# EAGLE design miditendo_rev5 (EAGLE 6.1)
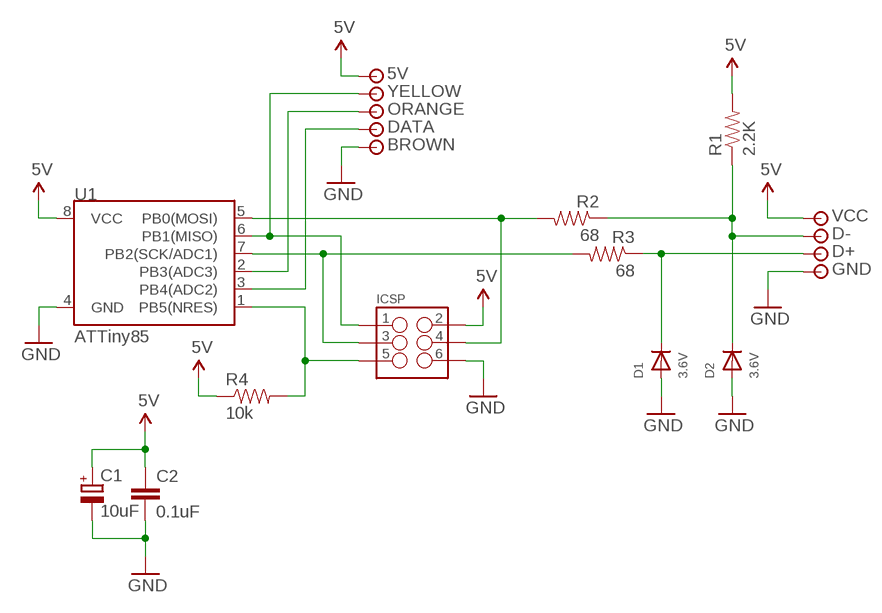
[diagram p0: schematic, sheet 1]

## Parts
5V  WIRE_JOINT  [THSOLDERPOINT]
BROWN  WIRE_JOINT  [THSOLDERPOINT]
C1  10uF  CPOL-EUB  [PANASONIC_B]
C2  0.1uF  C-EUC0805  [C0805]
D1  3.6V  DIODESOD-123  [SOD-123]
D2  3.6V  DIODESOD-123  [SOD-123]
D+  WIRE_JOINT  [THSOLDERPOINT]
D-  WIRE_JOINT  [THSOLDERPOINT]
DATA  WIRE_JOINT  [THSOLDERPOINT]
GND  WIRE_JOINT  [THSOLDERPOINT]
ICSP  M03X2SMT  [2X3_SMT_POSTS]
ORANGE  WIRE_JOINT  [THSOLDERPOINT]
R1  2.2K  RESISTOR0805  [0805]
R2  68  RESISTOR0805  [0805]
R3  68  RESISTOR0805  [0805]
R4  10k  RESISTOR0805  [0805]
U1  ATTiny85  ATTINY45TINY85-20-SMT  [SO08-EIAJ]
VCC  WIRE_JOINT  [THSOLDERPOINT]
YELLOW  WIRE_JOINT  [THSOLDERPOINT]

## Nets
5V: 5V.P$1 C1.+ C2.1 ICSP.2 R1.2 R4.1 U1.8(VCC) VCC.P$1
GND: BROWN.P$1 C1.- C2.2 D1.A D2.A GND.P$1 ICSP.6 U1.4(GND)
N$1: ICSP.4 R2.2 U1.5(PB0(MOSI))
N$2: ICSP.3 R3.2 U1.7(PB2(SCK/ADC1))
N$3: ICSP.1 U1.6(PB1(MISO)) YELLOW.P$1
N$4: ORANGE.P$1 U1.2(PB3(ADC3))
N$5: D2.C D-.P$1 R1.1 R2.1
N$6: DATA.P$1 U1.3(PB4(ADC2))
N$7: D1.C D+.P$1 R3.1
N$8: ICSP.5 R4.2 U1.1(PB5(NRES))

## Library data of the parts
5V BROWN D+ D- DATA GND ORANGE VCC YELLOW = miditendo:WIRE_JOINT
C1 = rcl:CPOL-EU: POLARIZED CAPACITOR, European symbol
C2 = rcl:C-EU: CAPACITOR, European symbol
D1 D2 = microbuilder:DIODE: Diode SMA Model Volts Amps Type Vf Vr Digikey # Notes SSA34-E3 40V 3A Schottky 480mV @ 3A 200uA @ 40V SSA34-E3/61TGITR-ND CDBA120-G 20V 1A Schottky 500mV @ 1A 500uA @ 20V 641-1014-6-ND REEL MBRA210 10V 2A Schottky 350mV @ 2A 700uA @ 10V MBRA210LT3 SOD-123 Model Volts Amps Type Vf Vr Order # Notes BAT54T1G 30V 200mA Schottky 800mV @ 200mA 2uA @ 25V BAT54T1GOSTR-ND B0530W 30V 500mA Schottky 430mV @ 500mA 130uA @ 30V B0530W-FDICT-ND REEL MBR120 1A 20V Schottky 340mV @ 1A MBR120VLSFT1GOSCT-ND SOD-323 Model Volts Amps Type Vf Vr Order # Notes PMEG2005EJ 20V 500mA Schottky 355mV @ 500mA 568-4110-1-ND ZLLS410 10V 570mA Schottky 380mV @ 570mA ZLLS410CT-ND 1N4148WS 75V 150mA Silicon/Simple 1V 1N4148WSFSCT-ND REEL SOD-523 Model Volts Amps Type Vf Vr Order # Notes BAT54XV2 30V 200mA Schottky 0.8V @ 100mA BAT54XV2CT-ND TB751S 30V 30mA Schottky RB751S-40TE61CT-ND SOT23-R/W (R = Solder Paste/Reflow Ovens, W = Hand-Soldering) Model Volts Amps Type Vf Vr Order # Notes BAT54FILM 40V 300mA Schottky 497-7162-1-ND
ICSP = SparkFun-Connectors:M03X2: 2x3 .1" header. Shrouded, with keying- CONN-10681 SMT- CONN-11415 Pogo pins- HW-11044; PROD_ID: CONN-11415
R1-R4 = miditendo:RESISTOR: RESISTOR
U1 = SparkFun-DigitalIC:ATTINY45: Atmel 8-pin 2/4/8kB flash uC; PROD_ID: IC-09092; VALUE: Tiny85-20-SMT

## Board
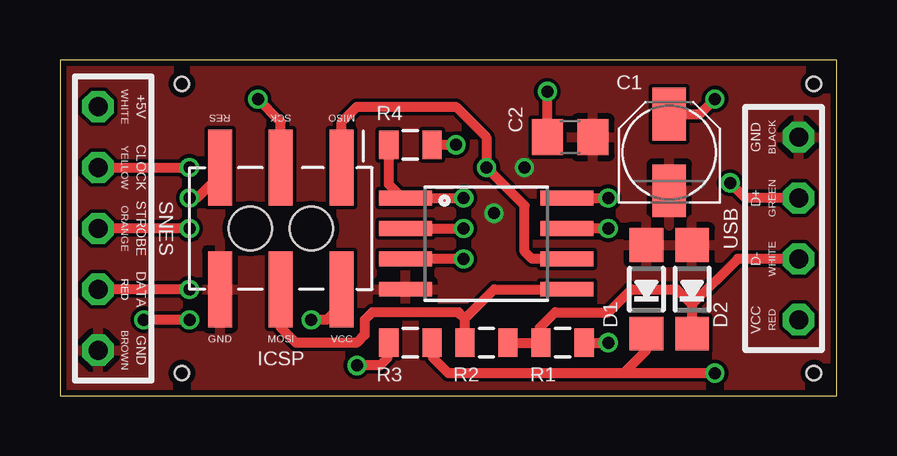
[diagram p1: board, top side]
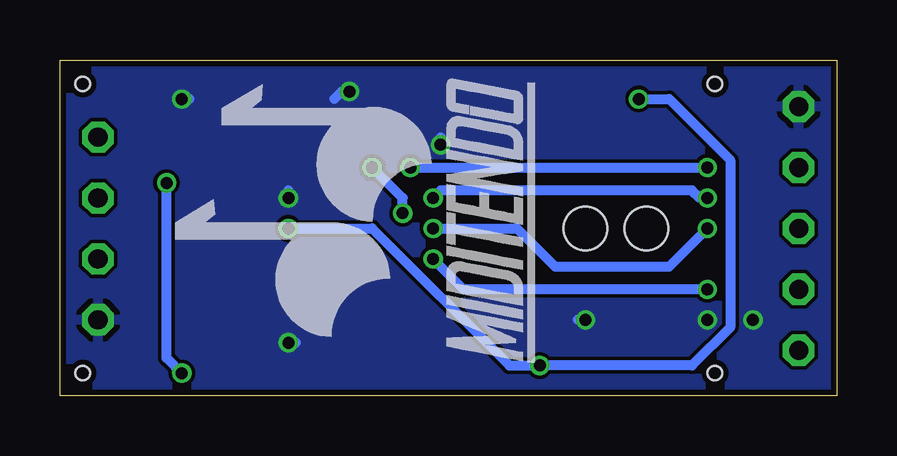
[diagram p2: board, bottom side, seen from below]

Size 32.38 x 14.02 mm. Coordinates in mm from the lower left corner, seen from the top.
Outline: 0,0 32.38,0 32.38,14.02 0,14.02 0,0
Copper layers (1*16): Top 0.035mm / dielectric 1.5mm / Bottom 0.035mm
Design rules: minimum track width 6mil, minimum drill 12mil, track to track 6mil, track to pad 6mil, pad to pad 6mil, via to via 6mil, smd to smd 0mil, copper to edge 10mil, drill to drill 10mil, minimum pad ring 10mil, minimum via ring 6mil, stop-mask expansion 2mil, vias tented up to drill 100mil, thermal gap 10mil
Holes 0.6 mm at 5.08,13.02 5.08,0.95 31.43,13.02 31.43,0.95

### Footprints (pad centres in the part's own frame; a part is rotated, then mirrored left to right if it is on the bottom)
THSOLDERPOINT = drill 0.8 octagon: P$1 0,0
PANASONIC_B = smd 2.2 x 1.4: + 1.6,0; - -1.6,0
C0805 = smd 1.3 x 1.5: 1 -0.95,0; 2 0.95,0
SOD-123 = smd 1.4 x 1.4: A 1.85,0; C -1.85,0
2X3_SMT_POSTS = smd 1 x 3.17: 1 -2.54,-2.54; 2 -2.54,2.54; 3 0,-2.54; 4 0,2.54; 5 2.54,-2.54; 6 2.54,2.54 | hole 1.8: -1.27,0; 1.27,0
0805 = smd 0.8 x 1.2: 1 -0.9,0; 2 0.9,0
SO08-EIAJ = smd 0.61 x 2.21: 1 -1.905,-3.378; 2 -0.635,-3.378; 3 0.635,-3.378; 4 1.905,-3.378; 5 1.905,3.353; 6 0.635,3.353; 7 -0.635,3.353; 8 -1.905,3.353

### Placement (x,y rotation side)
5V  1.59,12.06 0 top
BROWN  1.59,1.91 0 top
C1  25.4,10.16 90 top
C2  21.27,10.79 0 top
D1  24.45,4.45 90 top
D2  26.35,4.45 90 top
D+  30.8,8.26 0 top
D-  30.8,5.71 0 top
DATA  1.59,4.45 0 top
GND  30.8,10.79 0 top
ICSP  9.21,6.99 180 top
ORANGE  1.59,6.99 0 top
R1  20.95,2.22 0 top
R2  17.78,2.22 180 top
R3  14.61,2.22 180 top
R4  14.61,10.48 180 top
U1  17.78,6.35 270 top
U$1  [MIDITENDO]  20,7 90 bottom
VCC  30.8,3.17 0 top
YELLOW  1.59,9.53 0 top

### Tracks (layer width: path | path; a pad name or v marks a point on that pad's centre or on a via)
5V  (via drill 0.5)
  Top 0.406: C1.+ 26.68,11.76 v27.3,12.38 | R4.1 v16.51,10.48 | C2.1 v20.32,12.7 | ICSP.2 11.75,3.81 11.11,3.17 v10.48,3.17 | U1.8 v22.86,8.26 | R1.2 v22.86,2.22 | v5.4,3.17 v3.49,3.17
  Bottom 0.406: v27.3,12.38 26.99,12.38 | v16.51,10.48 16.51,10.79 | v20.32,12.7 20.64,12.7 20.95,12.38 | v10.48,3.17 10.79,3.17 | v22.86,8.26 22.86,8.57 | v22.86,2.22 22.54,2.22
  pour Bottom: 0,13.97 35.56,13.97 35.56,0 0,0
GND  (via drill 0.5)
  Bottom 0.406: v18.1,7.62 18.1,8.26 v19.37,9.53
  pour Top: 0,13.97 34.29,13.97 34.29,0 0,0
N$1
  Top 0.406: R2.2 16.88,3.23 | 16.88,3.23 18.1,4.45 U1.5 | 16.88,3.23 16.61,3.49 13.02,3.49 12.7,3.17 12.7,2.54 12.38,2.22 9.84,2.22 9.21,2.86 ICSP.4
N$2  (via drill 0.5)
  Top 0.406: v22.86,6.99 U1.7 | R3.2 13.65,2.22 13.65,1.59 13.34,1.27 v12.38,1.27 | ICSP.3 9.21,11.43 v8.26,12.38
  Bottom 0.406: v22.86,6.99 19.37,6.99 13.65,1.27 v12.38,1.27 6.03,1.27 4.45,2.86 4.45,9.84 6.99,12.38 v8.26,12.38
N$3  (via drill 0.5)
  Top 0.406: U1.6 19.68,5.71 19.37,6.03 19.37,7.94 v17.78,9.53 17.78,10.79 16.51,12.06 12.38,12.06 11.75,11.43 ICSP.1 | YELLOW.P$1 v5.4,9.53
  Bottom 0.406: v17.78,9.53 v5.4,9.53
N$4  (via drill 0.5)
  Top 0.406: v5.4,6.99 ORANGE.P$1 | U1.2 v16.83,6.99
  Bottom 0.406: v16.83,6.99 13.34,6.99 11.75,5.4 6.99,5.4 v5.4,6.99
N$5
  Top 0.406: R2.1 R1.1 | 20,2.27 20,2.86 20.64,3.49 22.86,3.49 23.81,4.45 25.72,4.45 26.35,3.81 | 26.35,3.81 D2.C 26.35,2.54 | D-.P$1 28.26,5.71 26.35,3.81
  Top 0.61: 20,2.27 R1.1
N$6  (via drill 0.5)
  Top 0.406: U1.3 v16.83,5.71 14.29,5.71 | v5.4,4.45 DATA.P$1
  Bottom 0.406: v5.4,4.45 15.56,4.45 v16.83,5.71
N$7  (via drill 0.5)
  Top 0.406: v27.3,0.95 23.5,0.95 | 23.5,0.95 16.19,0.95 15.56,1.59 15.56,2.22 R3.1 | D1.C 24.45,1.91 23.5,0.95 | D+.P$1 28.57,8.26 v27.94,8.89
  Top 0.61: 15.56,2.17 R3.1
  Bottom 0.406: v27.3,0.95 27.94,1.59 v27.94,8.89
N$8  (via drill 0.5)
  Top 0.406: R4.2 13.71,8.84 14.29,8.26 U1.1 v16.83,8.26 | v5.4,8.26 5.71,8.26 6.67,9.21 ICSP.5
  Bottom 0.406: v5.4,8.26 5.71,8.26 6.03,8.57 16.51,8.57 v16.83,8.26

### Text on the board
tPlace: WHITE | +5V | RES | SCK | MISO | GND | BLACK | YELLOW | CLOCK | D+ | GREEN | ORANGE | STROBE | SNES | USB | D- | WHITE | RED | RED | DATA | VCC | RED | BROWN | GND | GND | MOSI | VCC | ICSP